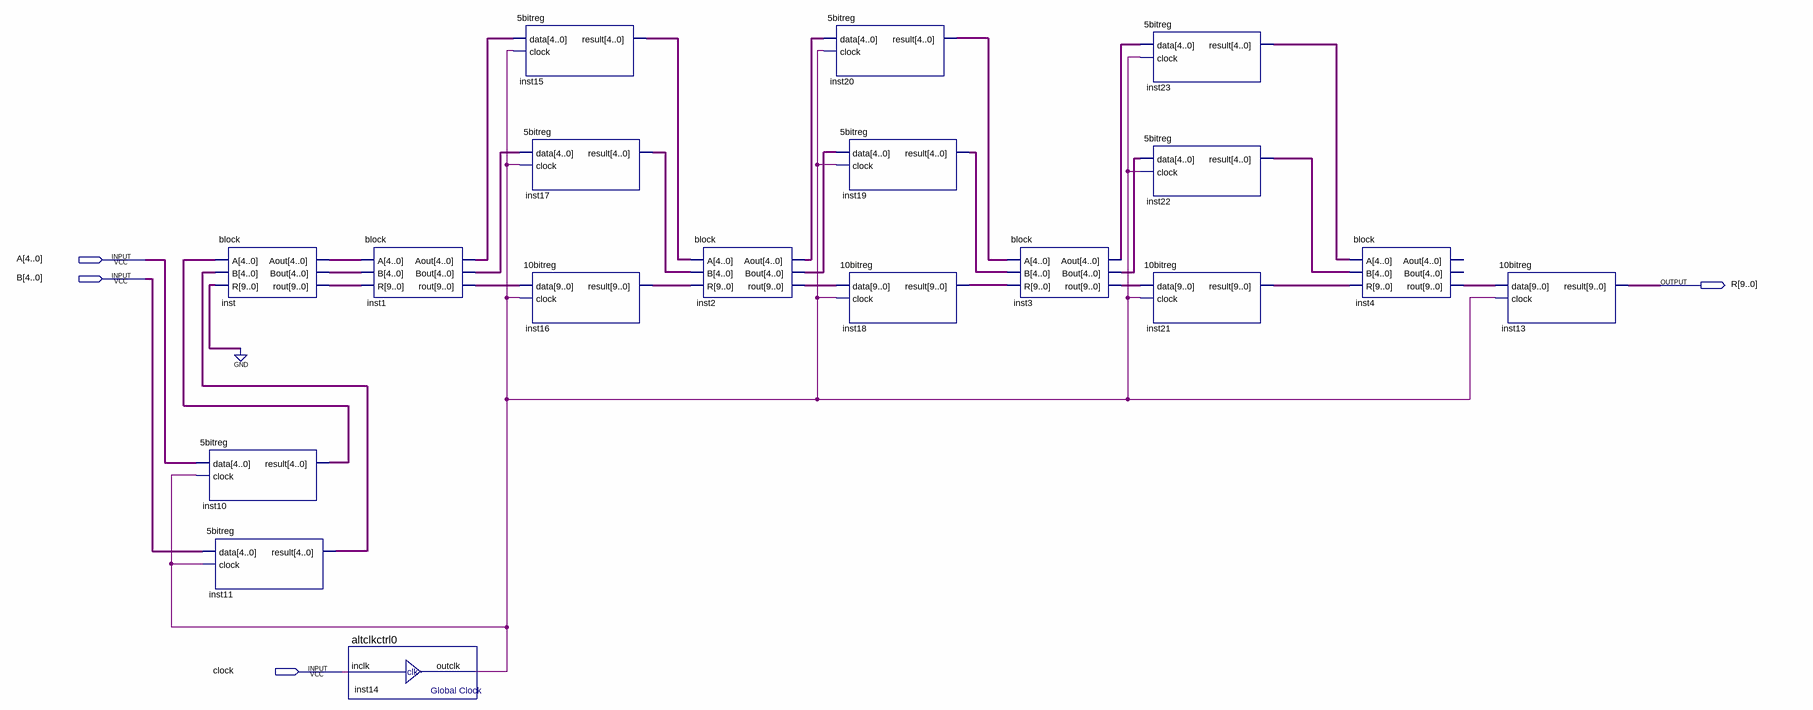
[diagram p0: schematic sheet]
// Quartus schematic multiplier.bdf as structural Verilog: 18 symbols, 4 pins
module multiplier (
  input  [4:0] A,
  input  [4:0] B,
  input  clock,
  output [9:0] R
);

  wire inst14_outclk;
  wire [4:0] inst1_aout, inst1_bout, inst2_aout, inst2_bout, inst3_aout, inst3_bout, inst10_result,
       inst11_result, inst15_result, inst17_result, inst19_result, inst20_result, inst22_result,
       inst23_result, inst_aout, inst_bout;
  wire [9:0] inst1_rout, inst2_rout, inst3_rout, inst4_rout, inst16_result, inst18_result, inst21_result,
       inst_rout;

  \5bitreg  inst10 (.data(A), .clock(inst14_outclk), .result(inst10_result));
  \5bitreg  inst11 (.data(B), .clock(inst14_outclk), .result(inst11_result));
  block inst (
    .A(inst10_result), .B(inst11_result), .R({10{1'b0}}), .Aout(inst_aout), .Bout(inst_bout), .rout(inst_rout));
  altclkctrl0 inst14 (.inclk(clock), .outclk(inst14_outclk));
  block inst1 (.A(inst_aout), .B(inst_bout), .R(inst_rout), .Aout(inst1_aout), .Bout(inst1_bout), .rout(inst1_rout));
  \5bitreg  inst15 (.data(inst1_aout), .clock(inst14_outclk), .result(inst15_result));
  \5bitreg  inst17 (.data(inst1_bout), .clock(inst14_outclk), .result(inst17_result));
  \10bitreg  inst16 (.data(inst1_rout), .clock(inst14_outclk), .result(inst16_result));
  block inst2 (
    .A(inst15_result), .B(inst17_result), .R(inst16_result), .Aout(inst2_aout), .Bout(inst2_bout),
    .rout(inst2_rout));
  \5bitreg  inst20 (.data(inst2_aout), .clock(inst14_outclk), .result(inst20_result));
  \5bitreg  inst19 (.data(inst2_bout), .clock(inst14_outclk), .result(inst19_result));
  \10bitreg  inst18 (.data(inst2_rout), .clock(inst14_outclk), .result(inst18_result));
  block inst3 (
    .A(inst20_result), .B(inst19_result), .R(inst18_result), .Aout(inst3_aout), .Bout(inst3_bout),
    .rout(inst3_rout));
  \5bitreg  inst23 (.data(inst3_aout), .clock(inst14_outclk), .result(inst23_result));
  \5bitreg  inst22 (.data(inst3_bout), .clock(inst14_outclk), .result(inst22_result));
  \10bitreg  inst21 (.data(inst3_rout), .clock(inst14_outclk), .result(inst21_result));
  block inst4 (.A(inst23_result), .B(inst22_result), .R(inst21_result), .rout(inst4_rout));  // open: Aout, Bout
  \10bitreg  inst13 (.data(inst4_rout), .clock(inst14_outclk), .result(R));
endmodule
